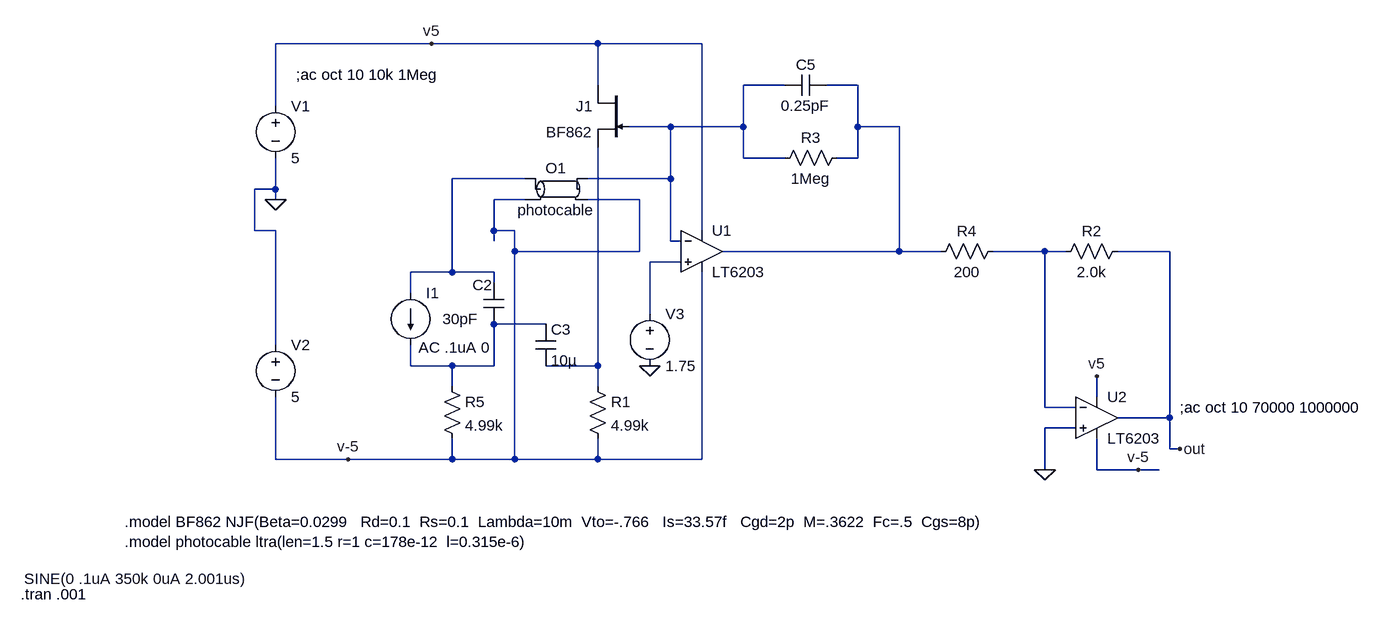
[diagram p0: schematic bootstrp6203bwsign&cable.asc]
bootstrp6203bwsign&cable.asc, the LTspice schematic file:
Version 4
SHEET 1 3232 872
WIRE 352 -256 112 -256
WIRE 608 -256 352 -256
WIRE 768 -256 608 -256
WIRE 608 -192 608 -256
WIRE 896 -192 832 -192
WIRE 1008 -192 960 -192
WIRE 112 -160 112 -256
WIRE 720 -128 656 -128
WIRE 832 -128 832 -192
WIRE 832 -128 720 -128
WIRE 1008 -128 1008 -192
WIRE 1072 -128 1008 -128
WIRE 832 -80 832 -128
WIRE 896 -80 832 -80
WIRE 1008 -80 1008 -128
WIRE 1008 -80 976 -80
WIRE 496 -48 384 -48
WIRE 720 -48 720 -128
WIRE 720 -48 592 -48
WIRE 112 -32 112 -80
WIRE 112 -32 80 -32
WIRE 112 -16 112 -32
WIRE 496 -16 448 -16
WIRE 672 -16 592 -16
WIRE 80 32 80 -32
WIRE 112 32 80 32
WIRE 448 32 448 -16
WIRE 480 32 448 32
WIRE 768 32 768 -256
WIRE 448 48 448 32
WIRE 720 48 720 -48
WIRE 736 48 720 48
WIRE 480 64 480 32
WIRE 672 64 672 -16
WIRE 672 64 480 64
WIRE 1072 64 1072 -128
WIRE 1072 64 800 64
WIRE 1136 64 1072 64
WIRE 1296 64 1216 64
WIRE 1328 64 1296 64
WIRE 1488 64 1408 64
WIRE 736 80 688 80
WIRE 384 96 384 -48
WIRE 384 96 320 96
WIRE 448 96 384 96
WIRE 448 112 448 96
WIRE 320 128 320 96
WIRE 688 160 688 80
WIRE 528 176 448 176
WIRE 112 208 112 32
WIRE 320 240 320 208
WIRE 384 240 320 240
WIRE 448 240 448 176
WIRE 448 240 384 240
WIRE 608 240 608 -96
WIRE 608 240 528 240
WIRE 384 272 384 240
WIRE 608 272 608 240
WIRE 1376 288 1376 256
WIRE 1296 304 1296 64
WIRE 1344 304 1296 304
WIRE 1488 320 1488 64
WIRE 1488 320 1408 320
WIRE 1344 336 1296 336
WIRE 1488 368 1488 320
WIRE 1504 368 1488 368
WIRE 112 384 112 288
WIRE 224 384 112 384
WIRE 384 384 384 352
WIRE 384 384 224 384
WIRE 480 384 480 64
WIRE 480 384 384 384
WIRE 608 384 608 352
WIRE 608 384 480 384
WIRE 768 384 768 96
WIRE 768 384 608 384
WIRE 1296 400 1296 336
WIRE 1376 400 1376 352
WIRE 1440 400 1376 400
WIRE 1472 400 1440 400
FLAG 112 -16 0
FLAG 688 240 0
FLAG 1376 256 v5
FLAG 1504 368 out
FLAG 1296 400 0
FLAG 1440 400 v-5
FLAG 352 -256 v5
FLAG 224 384 v-5
SYMBOL voltage 112 -176 R0
SYMATTR InstName V1
SYMATTR Value 5
SYMBOL current 320 128 R0
WINDOW 3 -595 440 Left 0
WINDOW 123 12 84 Left 0
WINDOW 39 0 0 Left 0
SYMATTR Value SINE(0 .1uA 350k 0uA 2.001us)
SYMATTR Value2 AC .1uA 0
SYMATTR InstName I1
SYMBOL voltage 112 192 R0
SYMATTR InstName V2
SYMATTR Value 5
SYMBOL cap 432 112 R0
WINDOW 0 -17 4 Left 0
WINDOW 3 -63 56 Left 0
SYMATTR InstName C2
SYMATTR Value 30pF
SYMBOL res 992 -96 R90
WINDOW 0 0 56 VBottom 0
WINDOW 3 32 56 VTop 0
SYMATTR InstName R3
SYMATTR Value 1Meg
SYMBOL cap 960 -208 R90
WINDOW 0 0 32 VBottom 0
WINDOW 3 32 32 VTop 0
SYMATTR InstName C5
SYMATTR Value 0.25pF
SYMBOL njf 656 -192 M0
SYMATTR InstName J1
SYMATTR Value BF862
SYMBOL res 592 256 R0
SYMATTR InstName R1
SYMATTR Value 4.99k
SYMBOL res 368 256 R0
SYMATTR InstName R5
SYMATTR Value 4.99k
SYMBOL Opamps\\LT6203 768 64 R0
SYMATTR InstName U1
SYMBOL voltage 688 144 R0
WINDOW 123 0 0 Left 0
WINDOW 39 0 0 Left 0
SYMATTR InstName V3
SYMATTR Value 1.75
SYMBOL res 1424 48 R90
WINDOW 0 0 56 VBottom 0
WINDOW 3 32 56 VTop 0
SYMATTR InstName R2
SYMATTR Value 2.0k
SYMBOL res 1232 48 R90
WINDOW 0 0 56 VBottom 0
WINDOW 3 32 56 VTop 0
SYMATTR InstName R4
SYMATTR Value 200
SYMBOL Opamps\\LT6203 1376 320 R0
SYMATTR InstName U2
SYMBOL cap 512 176 R0
SYMATTR InstName C3
SYMATTR Value 10µ
SYMBOL ltline 544 -32 R0
SYMATTR InstName O1
SYMATTR Value photocable
TEXT -120 480 Left 0 !.model BF862 NJF(Beta=0.0299   Rd=0.1  Rs=0.1  Lambda=10m  Vto=-.766   Is=33.57f   Cgd=2p  M=.3622  Fc=.5  Cgs=8p)\n.model photocable ltra(len=1.5 r=1 c=178e-12  l=0.315e-6)
TEXT 144 -208 Left 0 !;ac oct 10 10k 1Meg
TEXT -280 592 Left 0 !.tran .001
TEXT 1504 304 Left 0 !;ac oct 10 70000 1000000

The netlist it stands for:
* bootstrp6203bwsign&cable.asc
V1 v5 0 5
I1 N003 N006 SINE(0 .1uA 350k 0uA 2.001us) AC .1uA 0
V2 0 v-5 5
C2 N003 N006 30pF
R3 N002 N001 1Meg
C5 N002 N001 0.25pF
J1 v5 N001 N007 BF862
R1 N007 v-5 4.99k
R5 N006 v-5 4.99k
* U1: LT6203 (symbol Opamps\LT6203 not available, pins judged from their places): In+=N005 In-=N001 V+=v5 V-=v-5 OUT=N002
V3 N005 0 1.75
R2 out N004 2.0k
R4 N004 N002 200
* U2: LT6203 (symbol Opamps\LT6203 not available, pins judged from their places): In+=0 In-=N004 V+=v5 V-=v-5 OUT=out
C3 N006 N007 10µ
O1 N003 v-5 N001 v-5 photocable
.model NJF NJF
.model PJF PJF
.lib standard.jft
.model BF862 NJF(Beta=0.0299   Rd=0.1  Rs=0.1  Lambda=10m  Vto=-.766   Is=33.57f   Cgd=2p  M=.3622  Fc=.5  Cgs=8p)
.model photocable ltra(len=1.5 r=1 c=178e-12  l=0.315e-6)
;ac oct 10 10k 1Meg
.tran .001
;ac oct 10 70000 1000000
.backanno
.end